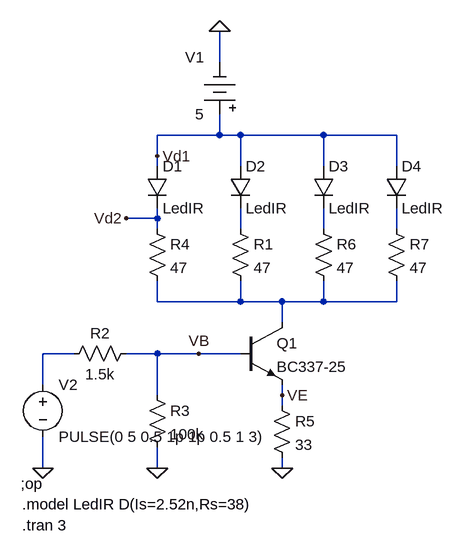
[diagram p0: schematic Draft1.asc]
Draft1.asc, the LTspice schematic file:
Version 4
SHEET 1 880 680
WIRE 96 -272 96 -320
WIRE 96 -160 96 -192
WIRE 96 -160 0 -160
WIRE 128 -160 96 -160
WIRE 256 -160 128 -160
WIRE 368 -160 256 -160
WIRE 0 -128 0 -160
WIRE 0 -112 0 -128
WIRE 128 -112 128 -160
WIRE 256 -112 256 -160
WIRE 368 -112 368 -160
WIRE 0 -32 0 -48
WIRE 0 -32 -48 -32
WIRE 0 -16 0 -32
WIRE 128 -16 128 -48
WIRE 256 -16 256 -48
WIRE 368 -16 368 -48
WIRE 0 96 0 64
WIRE 128 96 128 64
WIRE 128 96 0 96
WIRE 192 96 128 96
WIRE 256 96 256 64
WIRE 256 96 192 96
WIRE 368 96 368 64
WIRE 368 96 256 96
WIRE 192 128 192 96
WIRE -128 176 -176 176
WIRE 0 176 -48 176
WIRE 64 176 0 176
WIRE 128 176 64 176
WIRE -176 224 -176 176
WIRE 0 240 0 176
WIRE 192 240 192 224
WIRE 192 256 192 240
WIRE -176 352 -176 304
WIRE 0 352 0 320
WIRE 192 352 192 336
FLAG 0 352 0
FLAG 192 352 0
FLAG -176 352 0
FLAG 64 176 VB
FLAG 192 240 VE
FLAG 96 -320 0
FLAG 0 -128 Vd1
FLAG -48 -32 Vd2
DATAFLAG 80 208 "V(vb)-V(ve)"
DATAFLAG 336 272 "I(R5)"
DATAFLAG -112 -64 "V(vd1)-V(vd2)"
SYMBOL npn 128 128 R0
SYMATTR InstName Q1
SYMATTR Value BC337-25
SYMBOL res -144 192 R270
WINDOW 0 32 56 VTop 2
WINDOW 3 0 56 VBottom 2
SYMATTR InstName R2
SYMATTR Value 1.5k
SYMBOL res -16 224 R0
SYMATTR InstName R3
SYMATTR Value 100k
SYMBOL voltage -176 208 R0
WINDOW 123 0 0 Left 0
WINDOW 39 0 0 Left 0
SYMATTR InstName V2
SYMATTR Value PULSE(0 5 0.5 1p 1p 0.5 1 3)
SYMBOL res -16 -32 R0
SYMATTR InstName R4
SYMATTR Value 47
SYMBOL Misc\\battery 96 -176 R180
WINDOW 0 24 104 Left 2
WINDOW 3 24 16 Left 2
WINDOW 123 0 0 Left 0
WINDOW 39 0 0 Left 0
SYMATTR InstName V1
SYMATTR Value 5
SYMBOL diode -16 -112 R0
SYMATTR InstName D1
SYMATTR Value LedIR
SYMBOL res 112 -32 R0
SYMATTR InstName R1
SYMATTR Value 47
SYMBOL res 240 -32 R0
SYMATTR InstName R6
SYMATTR Value 47
SYMBOL res 352 -32 R0
SYMATTR InstName R7
SYMATTR Value 47
SYMBOL diode 112 -112 R0
SYMATTR InstName D2
SYMATTR Value LedIR
SYMBOL diode 240 -112 R0
SYMATTR InstName D3
SYMATTR Value LedIR
SYMBOL diode 352 -112 R0
SYMATTR InstName D4
SYMATTR Value LedIR
SYMBOL res 176 240 R0
SYMATTR InstName R5
SYMATTR Value 33
TEXT -210 376 Left 2 !;op
TEXT -208 408 Left 2 !.model LedIR D(Is=2.52n,Rs=38)
TEXT -208 440 Left 2 !.tran 3

The netlist it stands for:
* Draft1.asc
Q1 N004 VB VE 0 BC337-25
R2 N005 VB 1.5k
R3 VB 0 100k
V2 N005 0 PULSE(0 5 0.5 1p 1p 0.5 1 3)
R4 Vd2 N004 47
V1 Vd1 0 5
D1 Vd1 Vd2 LedIR
R1 N001 N004 47
R6 N002 N004 47
R7 N003 N004 47
D2 Vd1 N001 LedIR
D3 Vd1 N002 LedIR
D4 Vd1 N003 LedIR
R5 VE 0 33
.model D D
.lib standard.dio
.model NPN NPN
.model PNP PNP
.lib standard.bjt
;op
.model LedIR D(Is=2.52n,Rs=38)
.tran 3
.backanno
.end